# EAGLE design 3w-rgb-led-connector-mk-3.0 (EAGLE 6.5.0)
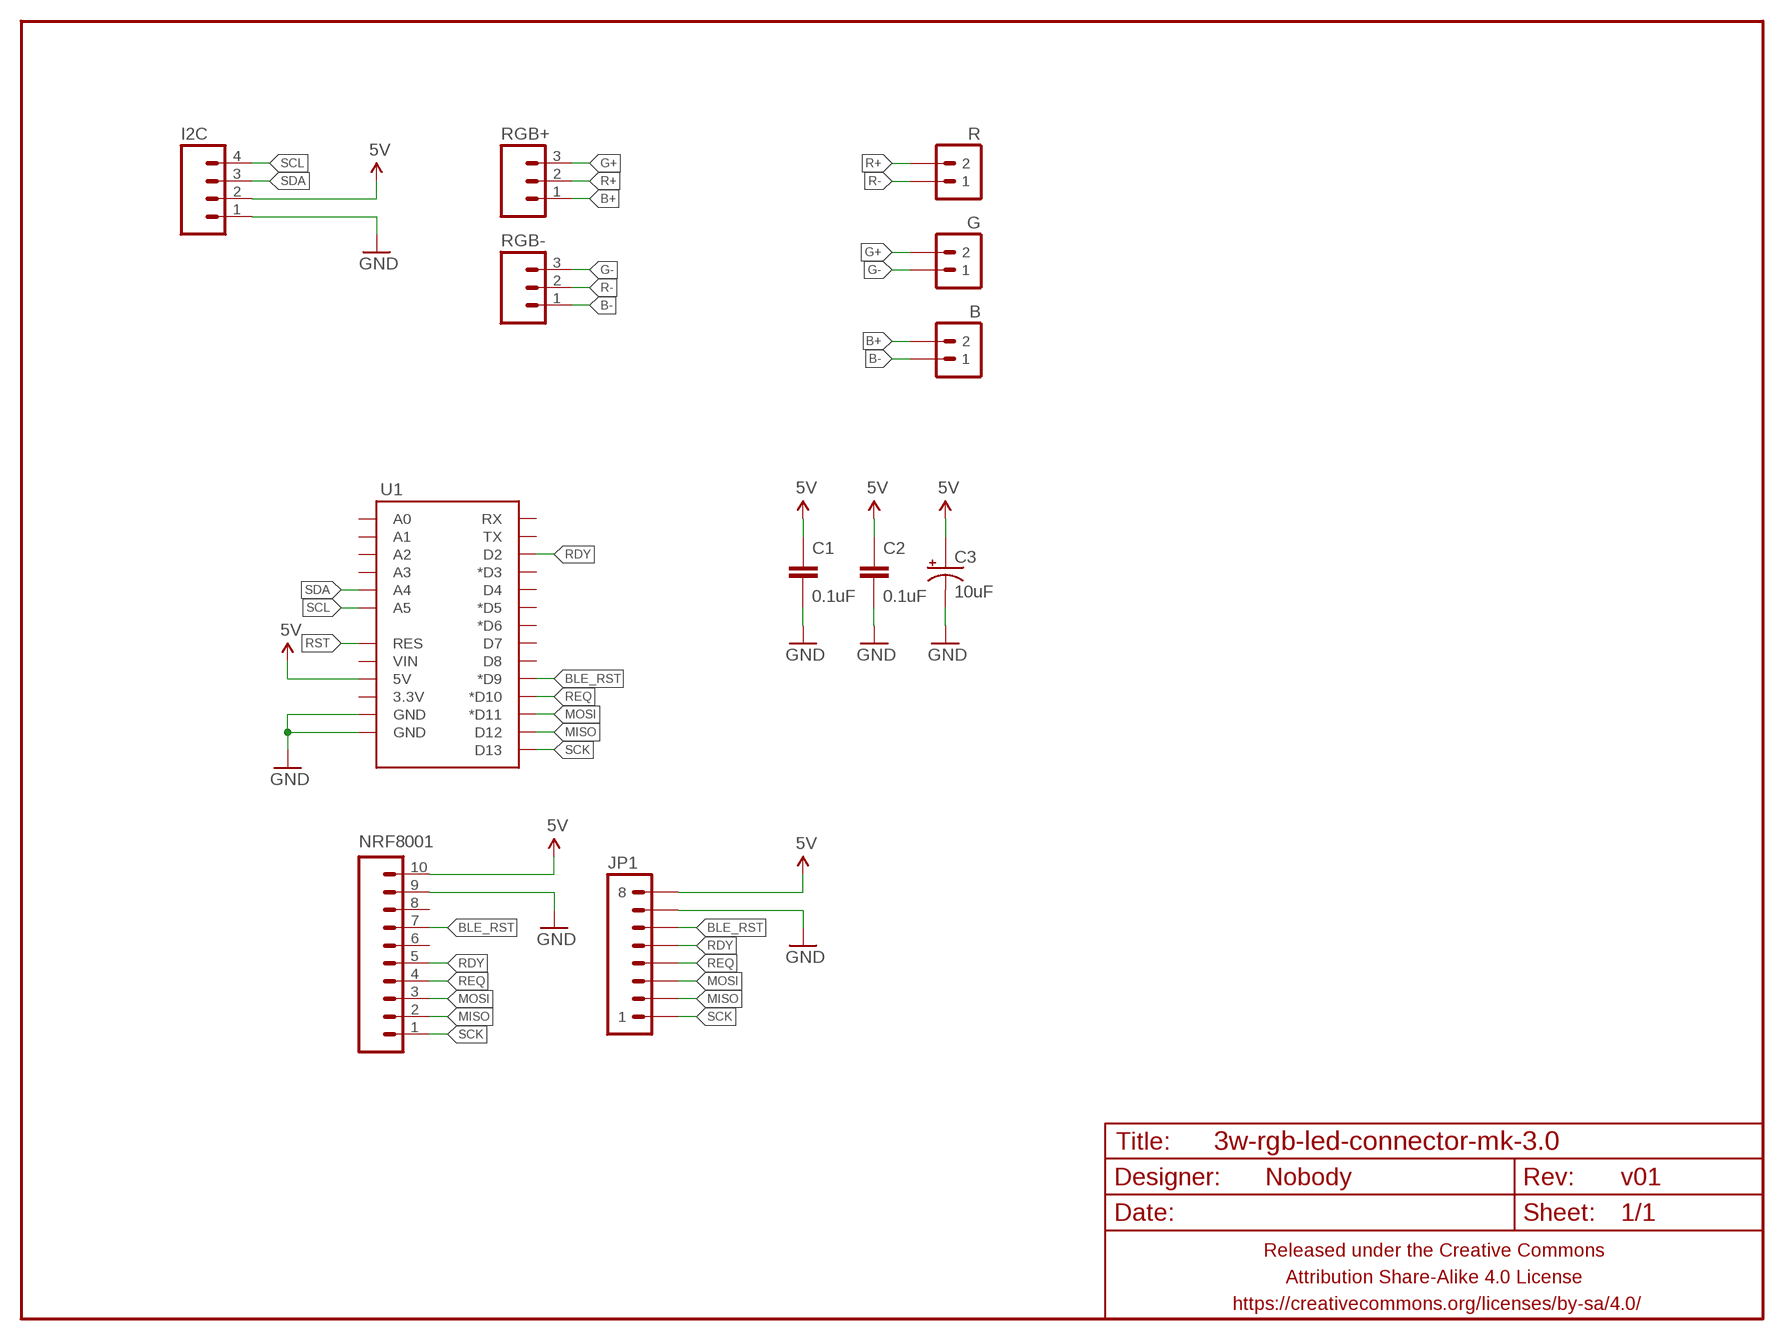
[diagram p0: schematic, sheet 1]

## Parts
B  M023.5MM-NO_SILK  [SCREWTERMINAL-3.5MM-2-NS]
C1  0.1uF  CAPACITOR-CERAMIC025-024X044  [C025-024X044]
C2  0.1uF  CAPACITOR-CERAMIC025-024X044  [C025-024X044]
C3  10uF  CAPACITOR-POLARIZEDE2-5  [E2-5]
FRAME1  FRAME-LETTERNO_PACKAGE  [DUMMY]
G  M023.5MM-NO_SILK  [SCREWTERMINAL-3.5MM-2-NS]
I2C  M04JST_XH_RA  [JST-4-XH-RA-PTH]
JP1  M081X08  [1X08]
NRF8001  M10PTH-SLIM-ASS  [1X10_PTH_SLIMASS]
R  M023.5MM-NO_SILK  [SCREWTERMINAL-3.5MM-2-NS]
RGB+  M03JST-XH-RA-PTH  [JST-3-XH-RA-PTH]
RGB-  M03JST-XH-RA-PTH  [JST-3-XH-RA-PTH]
U1  ARDUINO_SHIELD_SMALLER  [ARDUINO_SHIELD_NOOUTLINE_INSIDE_SMALLER]

## Nets
5V: C1.1 C2.1 C3.+ I2C.2 JP1.8 NRF8001.10 U1.5V
B+: B.2 RGB+.1
B-: B.1 RGB-.1
BLE_RST: JP1.6 NRF8001.7 U1.D9(*D9)
G+: G.2 RGB+.3
G-: G.1 RGB-.3
GND: C1.2 C2.2 C3.- I2C.1 JP1.7 NRF8001.9 U1.GND@0(GND) U1.GND@1(GND)
MISO: JP1.2 NRF8001.2 U1.D12
MOSI: JP1.3 NRF8001.3 U1.D11(*D11)
R+: R.2 RGB+.2
R-: R.1 RGB-.2
RDY: JP1.5 NRF8001.5 U1.D2
REQ: JP1.4 NRF8001.4 U1.D10(*D10)
RST: U1.RES
SCK: JP1.1 NRF8001.1 U1.D13
SCL: I2C.4 U1.A5
SDA: I2C.3 U1.A4
Unconnected: NRF8001.6 NRF8001.8 U1.3.3V U1.A0 U1.A1 U1.A2 U1.A3 U1.D3(*D3) U1.D4 U1.D5(*D5) U1.D6(*D6) U1.D7 U1.D8 U1.RX U1.TX U1.VIN

## Library data of the parts
B G R = A_butts:M02: Standard 2-pin 0.1" header. Use with - straight break away headers ( PRT-00116) - right angle break away headers (PRT-00553) - swiss pins (PRT-00743) - machine pins (PRT-00117) - female headers (PRT-00115) Molex polarized connector foot print use with: PRT-08233 with associated crimp pins and housings. 2.54_SCREWTERM for use with PRT-10571. 3.5mm Screw Terminal footprints for PRT-08084 5mm Screw Terminal footprints for use with PRT-08433
C1 C2 = A_butts:CAPACITOR-CERAMIC: CAPACITOR, European symbol
C3 = A_butts:CAPACITOR-POLARIZED: POLARIZED CAPACITOR, American symbol
FRAME1 = A_butts:FRAME-LETTER: Schematic Frame Standard 8.5x11 US Letter frame; DESIGNER: Nobody; VERSION: v01
I2C = A_butts:M04: Header 4 Standard 4-pin 0.1" header. Use with straight break away headers (SKU : PRT-00116), right angle break away headers (PRT-00553), swiss pins (PRT-00743), machine pins (PRT-00117), and female headers (PRT-00115). Molex polarized connector foot print use with SKU : PRT-08231 with associated crimp pins and housings. 1MM SMD Version SKU: PRT-10208
JP1 = A_butts:M08: Header 8 Standard 8-pin 0.1" header. Use with straight break away headers (SKU : PRT-00116), right angle break away headers (PRT-00553), swiss pins (PRT-00743), machine pins (PRT-00117), and female headers (PRT-00115).
NRF8001 = A_butts:M10: Header 10 Standard 10-pin 0.1" header. Use with straight break away headers (SKU : PRT-00116), right angle break away headers (PRT-00553), swiss pins (PRT-00743), machine pins (PRT-00117), and female headers (PRT-00115).
RGB+ RGB- = A_butts:M03: Header 3 Standard 3-pin 0.1" header. Use with straight break away headers (SKU : PRT-00116), right angle break away headers (PRT-00553), swiss pins (PRT-00743), machine pins (PRT-00117), and female headers (PRT-00115). Molex polarized connector foot print use with SKU : PRT-08232 with associated crimp pins and housings.
U1 = A_butts:ARDUINO_SHIELD_SMALLER

## Board
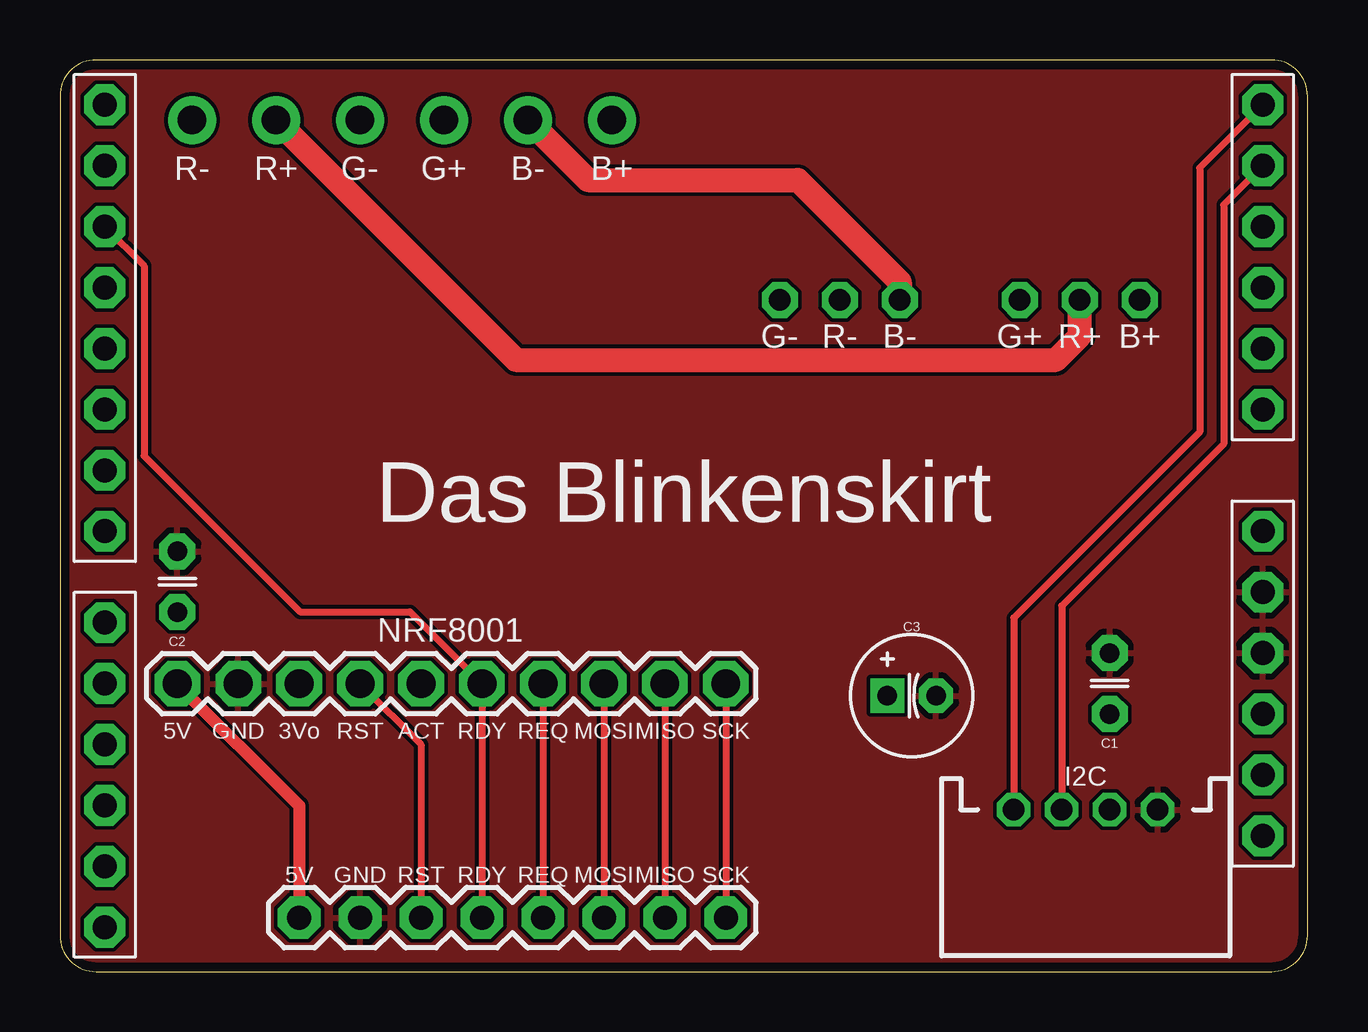
[diagram p1: board, top side]
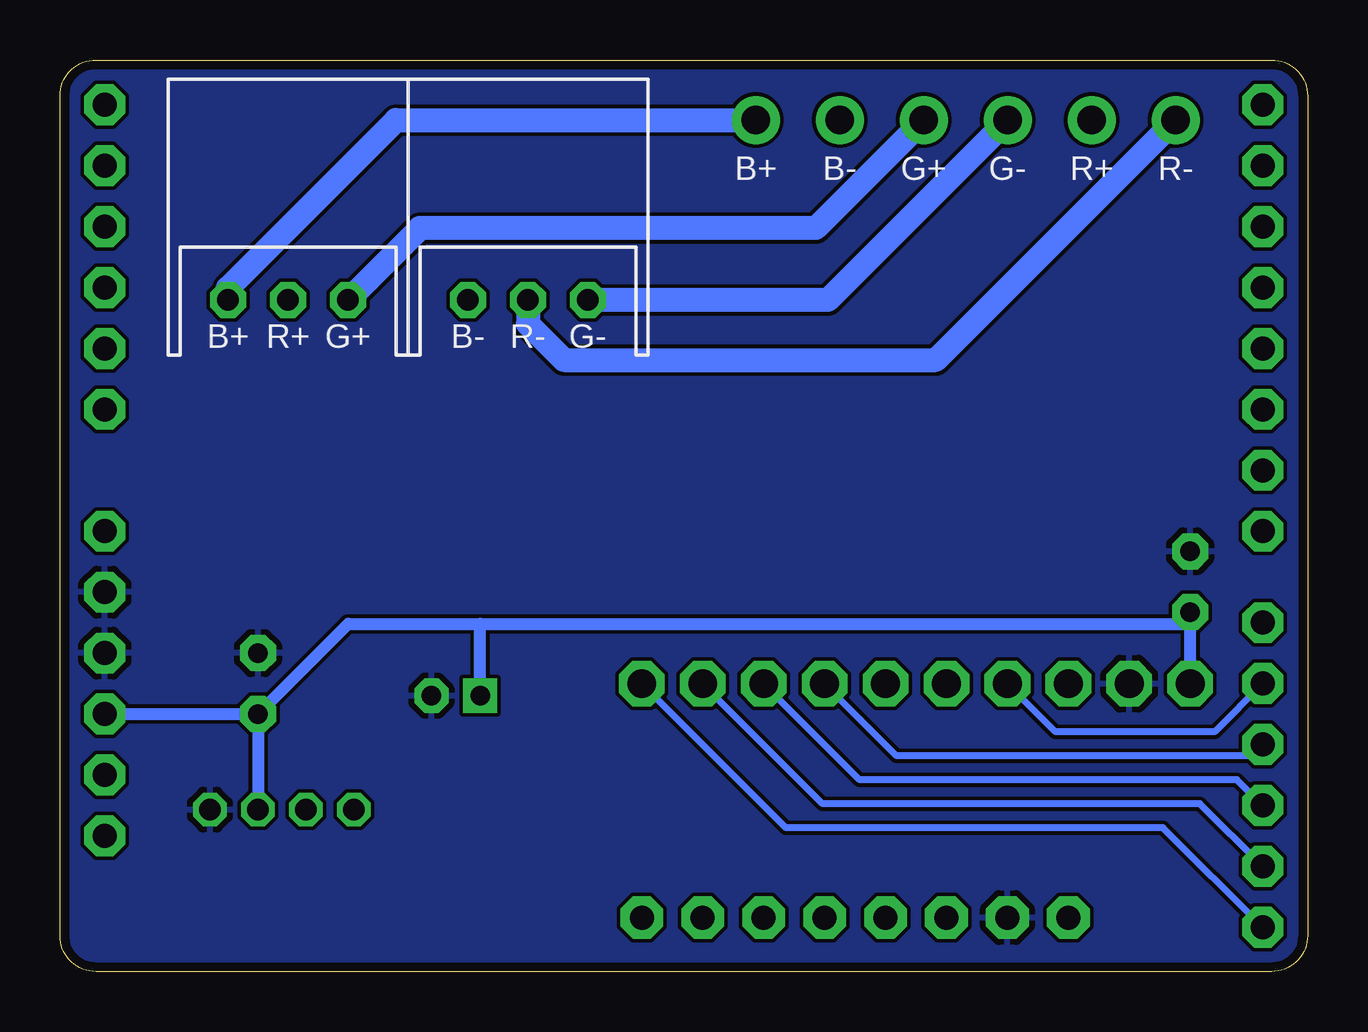
[diagram p2: board, bottom side, seen from below]

Size 52 x 38 mm. Coordinates in mm from the lower left corner, seen from the top.
Outline: 1.5,0 50.5,0 arc90 52,1.5 52,36.5 arc90 50.5,38 1.5,38 arc90 0,36.5 0,1.5 arc90 1.5,0
Copper layers (1*16): Top 0.0356mm / dielectric 1.5011mm / Bottom 0.0356mm
Design rules "LaenPCBOrder_2": minimum track width 6mil, minimum drill 13mil, track to track 6mil, track to pad 6mil, pad to pad 6mil, via to via 6mil, smd to smd 6mil, copper to edge 15mil, drill to drill 6mil, minimum pad ring 7mil, minimum via ring 7mil, stop-mask expansion 3mil, vias tented up to drill 20mil, thermal gap 10mil

### Footprints (pad centres in the part's own frame; a part is rotated, then mirrored left to right if it is on the bottom)
SCREWTERMINAL-3.5MM-2-NS = drill 1.2 pad 2: 1 0,0; 2 3.5,0
C025-024X044 = drill 0.813 pad 1.5 octagon: 1 -1.27,0; 2 1.27,0
E2-5 = drill 0.813 pad 1.422 square: + -1.016,0 | drill 0.813 pad 1.422 octagon: - 1.016,0
JST-4-PH-RA-PTH = drill 0.9 pad 1.4 octagon: 1 0,0; 2 2,0; 3 4,0; 4 6,0
1X08 = drill 1 pad 1.778 octagon: 1 0,0; 2 2.54,0; 3 5.08,0; 4 7.62,0; 5 10.16,0; 6 12.7,0; 7 15.24,0; 8 17.78,0
1X10_PTH_SLIMASS = drill 1.2 pad 1.9 octagon: 1 0,0; 2 2.54,0; 3 5.08,0; 4 7.62,0; 5 10.16,0; 6 12.7,0; 7 15.24,0; 8 17.78,0; 9 20.32,0; 10 22.86,0
JST-3-XH-RA-PTH = drill 0.9 pad 1.5 octagon: 1 -2.5,0; 2 0,0; 3 2.5,0
ARDUINO_SHIELD_NOOUTLINE_INSIDE_SMALLER = drill 1 pad 1.7 octagon: 3.3V 48.26,-27.94; 5V 48.26,-25.4; A0 48.26,-12.7; A1 48.26,-10.16; A2 48.26,-7.62; A3 48.26,-5.08; A4 48.26,-2.54; A5 48.26,0; D2 0,-5.08; D3 0,-7.62; D4 0,-10.16; D5 0,-12.7; D6 0,-15.24; D7 0,-17.78; D8 0,-21.59; D9 0,-24.13; D10 0,-26.67; D11 0,-29.21; D12 0,-31.75; D13 0,-34.29; GND@0 48.26,-22.86; GND@1 48.26,-20.32; RES 48.26,-30.48; RX 0,0; TX 0,-2.54; VIN 48.26,-17.78

### Placement (x,y rotation side)
B  19.5,35.5 180 bottom
C1  43.75,12.01 90 top
C2  4.89,16.25 90 top
C3  35.5,11.5 0 top
FRAME1  0.5,0.5 0 top
G  12.5,35.5 180 bottom
I2C  M04JST-PTH  [JST-4-PH-RA-PTH]  45.75,6.75 180 top
JP1  27.75,2.25 180 top
NRF8001  27.75,12 180 top
R  5.5,35.5 180 bottom
RGB+  42.5,28 0 bottom
RGB-  32.5,28 0 bottom
U1  1.87,36.13 0 top

### Tracks (layer width: path | path; a pad name or v marks a point on that pad's centre or on a via)
5V
  Top 0.5: NRF8001.10 9.97,6.92 JP1.8
  Bottom 0.5: 34.48,14.5 39.98,14.5 C1.1 | 34.48,14.5 4.89,14.5 | U1.5V C1.1 | C1.1 I2C.2 | C3.+ 34.48,14.5 | NRF8001.10 4.89,14.5 | 4.89,14.5 C2.1
B+
  Bottom 1: RGB+.1 45,28.5 38,35.5 B.2
B-
  Top 1: B.1 22,33 30.75,33 35,28.75 RGB-.1
BLE_RST
  Top 0.3: NRF8001.7 15.05,9.46 JP1.6
  Bottom 0.3: U1.D9 3.88,10 10.51,10 NRF8001.7
G+
  Bottom 1: G.2 20.5,31 37,31 RGB+.3
G-
  Bottom 1: G.1 20,28 RGB-.3
GND
  pour Top: 52,36.5 52,1.5 arc-90 50.5,0 1.5,0 arc-90 0,1.5 0,36.5 arc-90 1.5,38 50.5,38 arc-90
  pour Bottom: 52,36.5 52,1.5 arc-90 50.5,0 1.5,0 arc-90 0,1.5 0,36.5 arc-90 1.5,38 50.5,38 arc-90
MISO
  Top 0.3: NRF8001.2 JP1.2
  Bottom 0.3: U1.D12 4.49,7 20.21,7 NRF8001.2
MOSI
  Top 0.3: NRF8001.3 JP1.3
  Bottom 0.3: U1.D11 2.94,8 18.67,8 NRF8001.3
R+
  Top 1: RGB+.2 42.5,26.5 41.5,25.5 19,25.5 R.2
R-
  Bottom 1: RGB-.2 32.5,27 31,25.5 15.5,25.5 R.1
RDY
  Top 0.3: JP1.5 NRF8001.5 14.59,15 10,15 3.5,21.5 3.5,29.43 U1.D2
REQ
  Top 0.3: NRF8001.4 JP1.4
  Bottom 0.3: U1.D10 2.33,9 17.13,9 NRF8001.4
SCK
  Top 0.3: NRF8001.1 JP1.1
  Bottom 0.3: U1.D13 6.03,6 21.75,6 NRF8001.1
SCL
  Top 0.3: U1.A5 47.5,33.51 47.5,22.5 39.75,14.75 I2C.4
SDA
  Top 0.3: U1.A4 48.5,31.96 48.5,22 41.75,15.25 I2C.3

### Text on the board
tPlace: R- | R+ | G- | G+ | B- | B+ | G- | R- | B- | G+ | R+ | B+ | Das Blinkenskirt | 5V | GND | 3Vo | RST | ACT | RDY | REQ | MOSI | MISO | SCK | 5V | GND | RST | RDY | REQ | MOSI | MISO | SCK
bPlace: R- | R+ | G- | G+ | B- | B+ | G- | R- | B- | G+ | R+ | B+